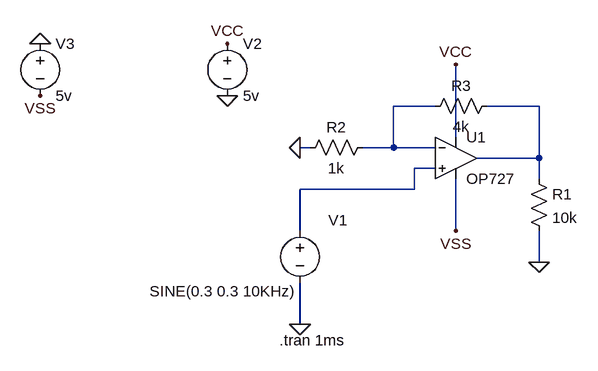
[diagram p0: schematic 6432106821-PB3.asc]
6432106821-PB3.asc, the LTspice schematic file:
Version 4
SHEET 1 880 680
WIRE 16 48 -48 48
WIRE 176 48 96 48
WIRE 48 96 48 -16
WIRE -176 112 -192 112
WIRE -48 112 -48 48
WIRE -48 112 -96 112
WIRE 16 112 -48 112
WIRE 176 128 176 48
WIRE 176 128 80 128
WIRE 16 144 -16 144
WIRE 176 160 176 128
WIRE -16 176 -16 144
WIRE -16 176 -192 176
WIRE -192 240 -192 176
WIRE 48 240 48 160
WIRE 176 288 176 240
WIRE -192 384 -192 320
FLAG 176 288 0
FLAG -192 384 0
FLAG 48 -16 VCC
FLAG -304 -48 VCC
FLAG -304 32 0
FLAG 48 240 VSS
FLAG -592 -48 0
FLAG -592 32 VSS
FLAG -192 112 0
SYMBOL res 160 144 R0
SYMATTR InstName R1
SYMATTR Value 10k
SYMBOL voltage -192 224 R0
WINDOW 123 0 0 Left 0
WINDOW 39 0 0 Left 0
WINDOW 0 44 0 Left 2
WINDOW 3 -232 109 Left 2
SYMATTR InstName V1
SYMATTR Value SINE(0.3 0.3 10KHz)
SYMBOL voltage -304 -64 R0
WINDOW 123 0 0 Left 0
WINDOW 39 0 0 Left 0
SYMATTR InstName V2
SYMATTR Value 5v
SYMBOL Opamps\\OP727 48 64 R0
SYMATTR InstName U1
SYMBOL res 112 32 R90
WINDOW 0 0 56 VBottom 2
WINDOW 3 32 56 VTop 2
SYMATTR InstName R3
SYMATTR Value 4k
SYMBOL voltage -592 -64 R0
WINDOW 123 0 0 Left 0
WINDOW 39 0 0 Left 0
SYMATTR InstName V3
SYMATTR Value 5v
SYMBOL res -80 96 R90
WINDOW 0 0 56 VBottom 2
WINDOW 3 32 56 VTop 2
SYMATTR InstName R2
SYMATTR Value 1k
TEXT -224 408 Left 2 !.tran 1ms

The netlist it stands for:
* 6432106821-PB3.asc
R1 N002 0 10k
V1 N003 0 SINE(0.3 0.3 10KHz)
V2 VCC 0 5v
XU1 N003 N001 VCC VSS N002 OP727  ; pins In+ In- V+ V- OUT
R3 N002 N001 4k
V3 0 VSS 5v
R2 N001 0 1k
.tran 1ms
.backanno
.end